# EAGLE design PowerOut (EAGLE 9.3.0)
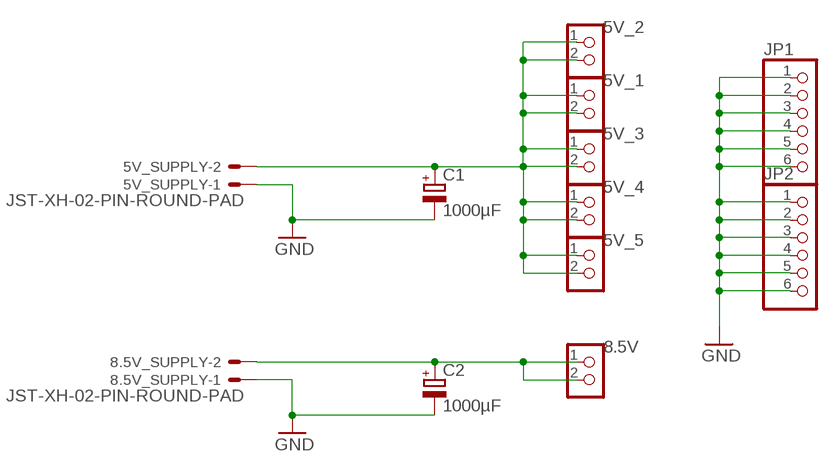
[diagram p0: schematic, sheet 1]

## Parts
5V_1  CON_TERMINAL_BLOCK_02-5MM  [TERMINAL_BLOCK_2P_5]
5V_2  CON_TERMINAL_BLOCK_02-5MM  [TERMINAL_BLOCK_2P_5]
5V_3  CON_TERMINAL_BLOCK_02-5MM  [TERMINAL_BLOCK_2P_5]
5V_4  CON_TERMINAL_BLOCK_02-5MM  [TERMINAL_BLOCK_2P_5]
5V_5  CON_TERMINAL_BLOCK_02-5MM  [TERMINAL_BLOCK_2P_5]
5V_SUPPLY  JST-XH-02-PIN-ROUND-PAD  [JST-XH-02-PACKAGE-ROUND-PAD]
8.5V  CON_TERMINAL_BLOCK_02-5MM  [TERMINAL_BLOCK_2P_5]
8.5V_SUPPLY  JST-XH-02-PIN-ROUND-PAD  [JST-XH-02-PACKAGE-ROUND-PAD]
C1  1000µF  CPOL-EUE5-10.5  [E5-10,5]
C2  1000µF  CPOL-EUE5-10.5  [E5-10,5]
JP1  PINHD-1X6  [1X06]
JP2  PINHD-1X6  [1X06]

## Nets
GND: 5V_SUPPLY.1 8.5V_SUPPLY.1 C1.- C2.- JP1.1 JP1.2 JP1.3 JP1.4 JP1.5 JP1.6 JP2.1 JP2.2 JP2.3 JP2.4 JP2.5 JP2.6
N$1 [LARGE]: 5V_1.1 5V_1.2 5V_2.1 5V_2.2 5V_3.1 5V_3.2 5V_4.1 5V_4.2 5V_5.1 5V_5.2 5V_SUPPLY.2 C1.+
N$2 [LARGE]: 8.5V.1 8.5V.2 8.5V_SUPPLY.2 C2.+

## Library data of the parts
5V_1-5V_5 8.5V = dp_devices:CON_TERMINAL_BLOCK_02: 2 poles wire to board terminal block
5V_SUPPLY 8.5V_SUPPLY = Rembrandt Electronics - JST XH Connectors v1-0:JST-XH-02-PIN: JST XH Connector 2 Pin Wire to board connector. Pitch: 2,54 mm, (0.100") Number of pins: 2 Created by Rembrandt Electronics www.rembrandtelectronics.com
C1 C2 = rcl:CPOL-EU: POLARIZED CAPACITOR, European symbol; SPICEPREFIX: C
JP1 JP2 = adafruit:PINHD-1X6: PIN HEADER

## Net classes
0 default: width 0.61 mm, clearance 0.305 mm
1 LARGE: width 2 mm

## Board
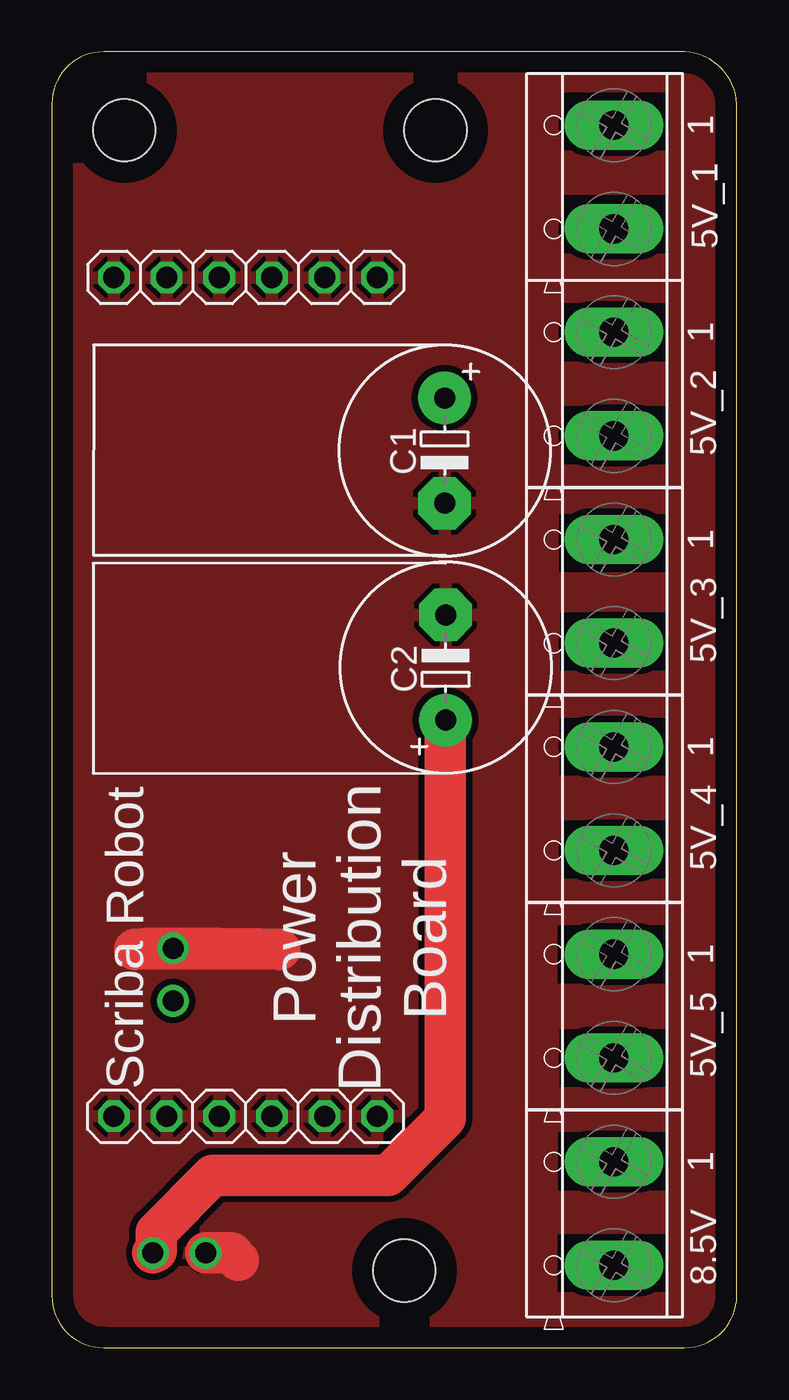
[diagram p1: board, top side]
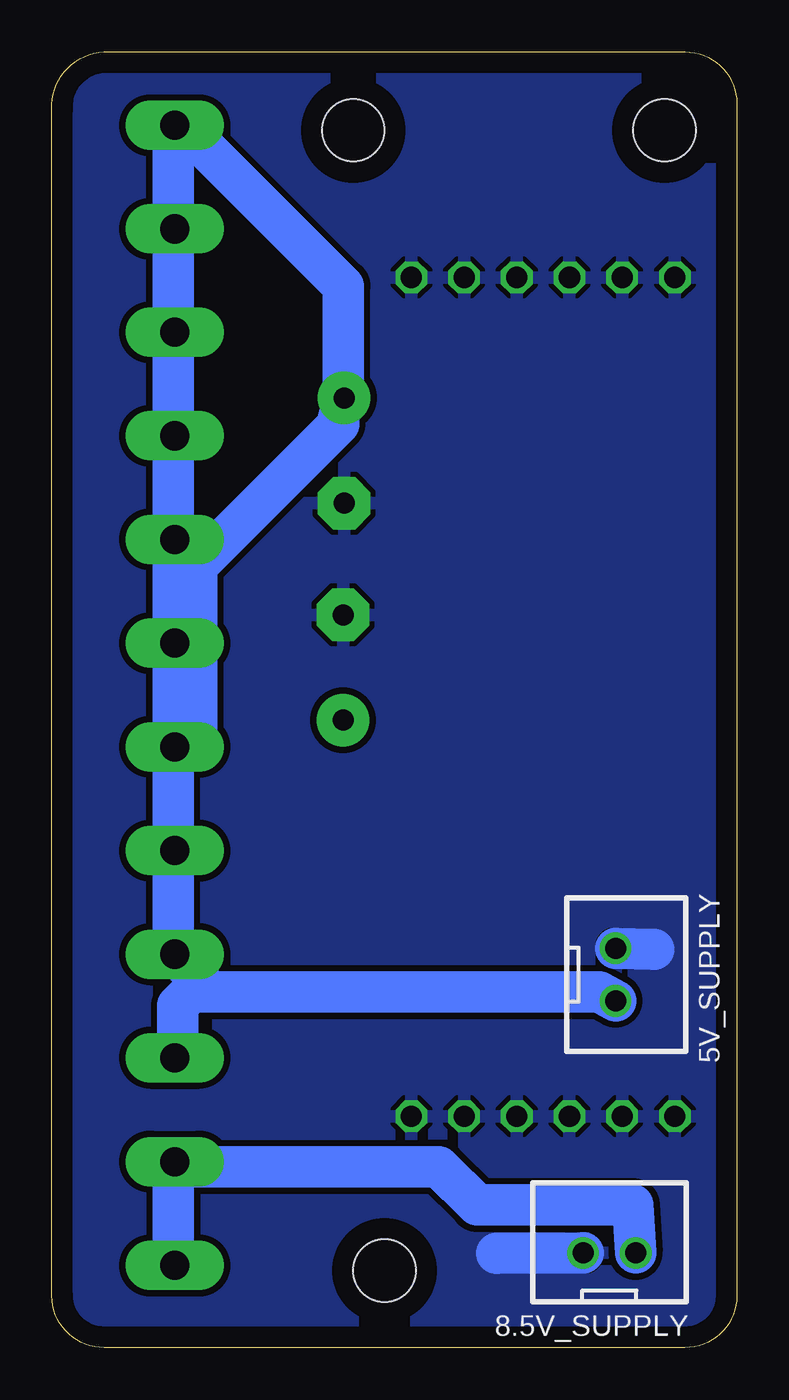
[diagram p2: board, bottom side, seen from below]

Size 33.03 x 62.5 mm. Coordinates in mm from the lower left corner, seen from the top.
Outline: 30.52,62.5 2.49,62.5 arc90 0,60 0,2.5 arc90 2.5,0 30.5,0 arc90 33.02,2.5 33.02,59.72 arc90 30.52,62.5
Copper layers (1*16): Top 0.035mm / dielectric 1.5mm / Bottom 0.035mm
Design rules "default": minimum track width 6mil, minimum drill 0.35mm, track to track 6mil, track to pad 6mil, pad to pad 6mil, via to via 6mil, smd to smd 6mil, copper to edge 40mil, drill to drill 6mil, minimum pad ring 10mil, minimum via ring 8mil, stop-mask expansion 4mil, vias tented up to drill 0mil, thermal gap 10mil
Holes 3 mm at 17,3.72 3.5,58.72 18.5,58.72
tRestrict: area 24.5,57.7 to 29.7,60.5; area 24.6,52.8 to 29.8,55.6; area 24.5,47.6 to 29.7,50.4; area 24.6,42.6 to 29.8,45.4; area 24.5,37.4 to 29.6,40.2; area 24.5,32.7 to 29.7,35.5; area 24.5,27.6 to 29.7,30.4; area 24.5,22.6 to 29.7,25.4; area 24.4,17.6 to 29.6,20.4; area 24.5,12.6 to 29.7,15.4; area 24.4,7.6 to 29.6,10.4; area 24.4,2.7 to 29.6,5.5

### Footprints (pad centres in the part's own frame; a part is rotated, then mirrored left to right if it is on the bottom)
TERMINAL_BLOCK_2P_5 = drill 1.4 pad 2.38 long: 1 2.5,-0.45; 2 -2.5,-0.45
JST-XH-02-PACKAGE-ROUND-PAD = drill 1.016: 1 -1.27,0; 2 1.27,0
E5-10,5 = drill 1.016 pad 2.54: + -2.54,0 | drill 1.016 pad 2.54 octagon: - 2.54,0
1X06 = drill 1.016 octagon: 1 -6.35,0; 2 -3.81,0; 3 -1.27,0; 4 1.27,0; 5 3.81,0; 6 6.35,0

### Placement (x,y rotation side)
5V_1  26.65,56.46 90 top
5V_2  26.65,46.48 90 top
5V_3  26.65,36.48 90 top
5V_4  26.65,26.48 90 top
5V_5  26.65,16.48 90 top
5V_SUPPLY  5.84,18 270 bottom
8.5V  26.65,6.47 90 top
8.5V_SUPPLY  6.14,4.57 0 bottom
C1  18.93,43.27 270 top
C2  18.98,32.81 90 top
JP1  9.34,11.16 180 top
JP2  9.34,51.62 0 top

### Tracks (layer width: path | path; a pad name or v marks a point on that pad's centre or on a via)
GND
  Top 2: 8.5V_SUPPLY.1 8.64,4.57 8.99,4.22 | 10.99,19.22 9.99,19.23 8,19.25 5V_SUPPLY.1 arc4 4,19.22
  Bottom 2: 8.5V_SUPPLY.1 11.56,4.56 | 5V_SUPPLY.1 4,19.22
  pour Bottom: 34.28,-1.28 -1.27,-1.28 -1.27,63.22 34.28,63.22
  pour Top: -1.27,-1.28 -1.27,63.22 34.28,63.22 34.28,-1.28
N$1
  Bottom 2: 26.31,17.15 6.64,17.15 5V_SUPPLY.2 | 5V_5.2 26.96,13.99 26.96,16.5 26.31,17.15 | 26.31,17.15 25.81,17.65 26.96,18.79 5V_5.1 27.18,19.93 27.18,23.89 5V_4.2 27.17,24.7 27.17,28.92 26.27,29.24 26.04,29.47 26.04,37.7 19.2,44.55 19.2,44.89 C1.+ 18.97,45.81 18.97,51.2 26.27,58.5 5V_1.1 | 27.17,28.93 5V_4.1 27.17,29.73 27.17,33.81 5V_3.2 27.18,34.93 27.18,38.82 5V_3.1 27.18,39.96 27.18,43.91 5V_2.2 27.18,44.83 27.18,48.94 5V_2.1 27.18,49.86 27.18,53.79 5V_1.2 27.18,54.94 27.18,58.96 | 27.18,58.96 27.18,59 | 27.18,58.82 5V_1.1 | 27.18,58.96 5V_1.1
N$2
  Top 2: 8.5V_SUPPLY.2 5.02,4.66 5.02,5.57 7.77,8.32 16.23,8.32 18.97,11.06 C2.+
  Bottom 2: 27.18,4.1 27.18,7.97 8.5V.1 26.7,8.73 14.37,8.73 12.52,6.88 5.01,6.88 8.5V_SUPPLY.2 | 27.18,4.1 27.18,3.93 | 27.19,4.09 8.5V.2 27.18,4.1

### Text on the board
tNames: Scriba Robot | Power / Distribution / Board